# EAGLE design GK_Roland_Breakout (EAGLE 6.3)
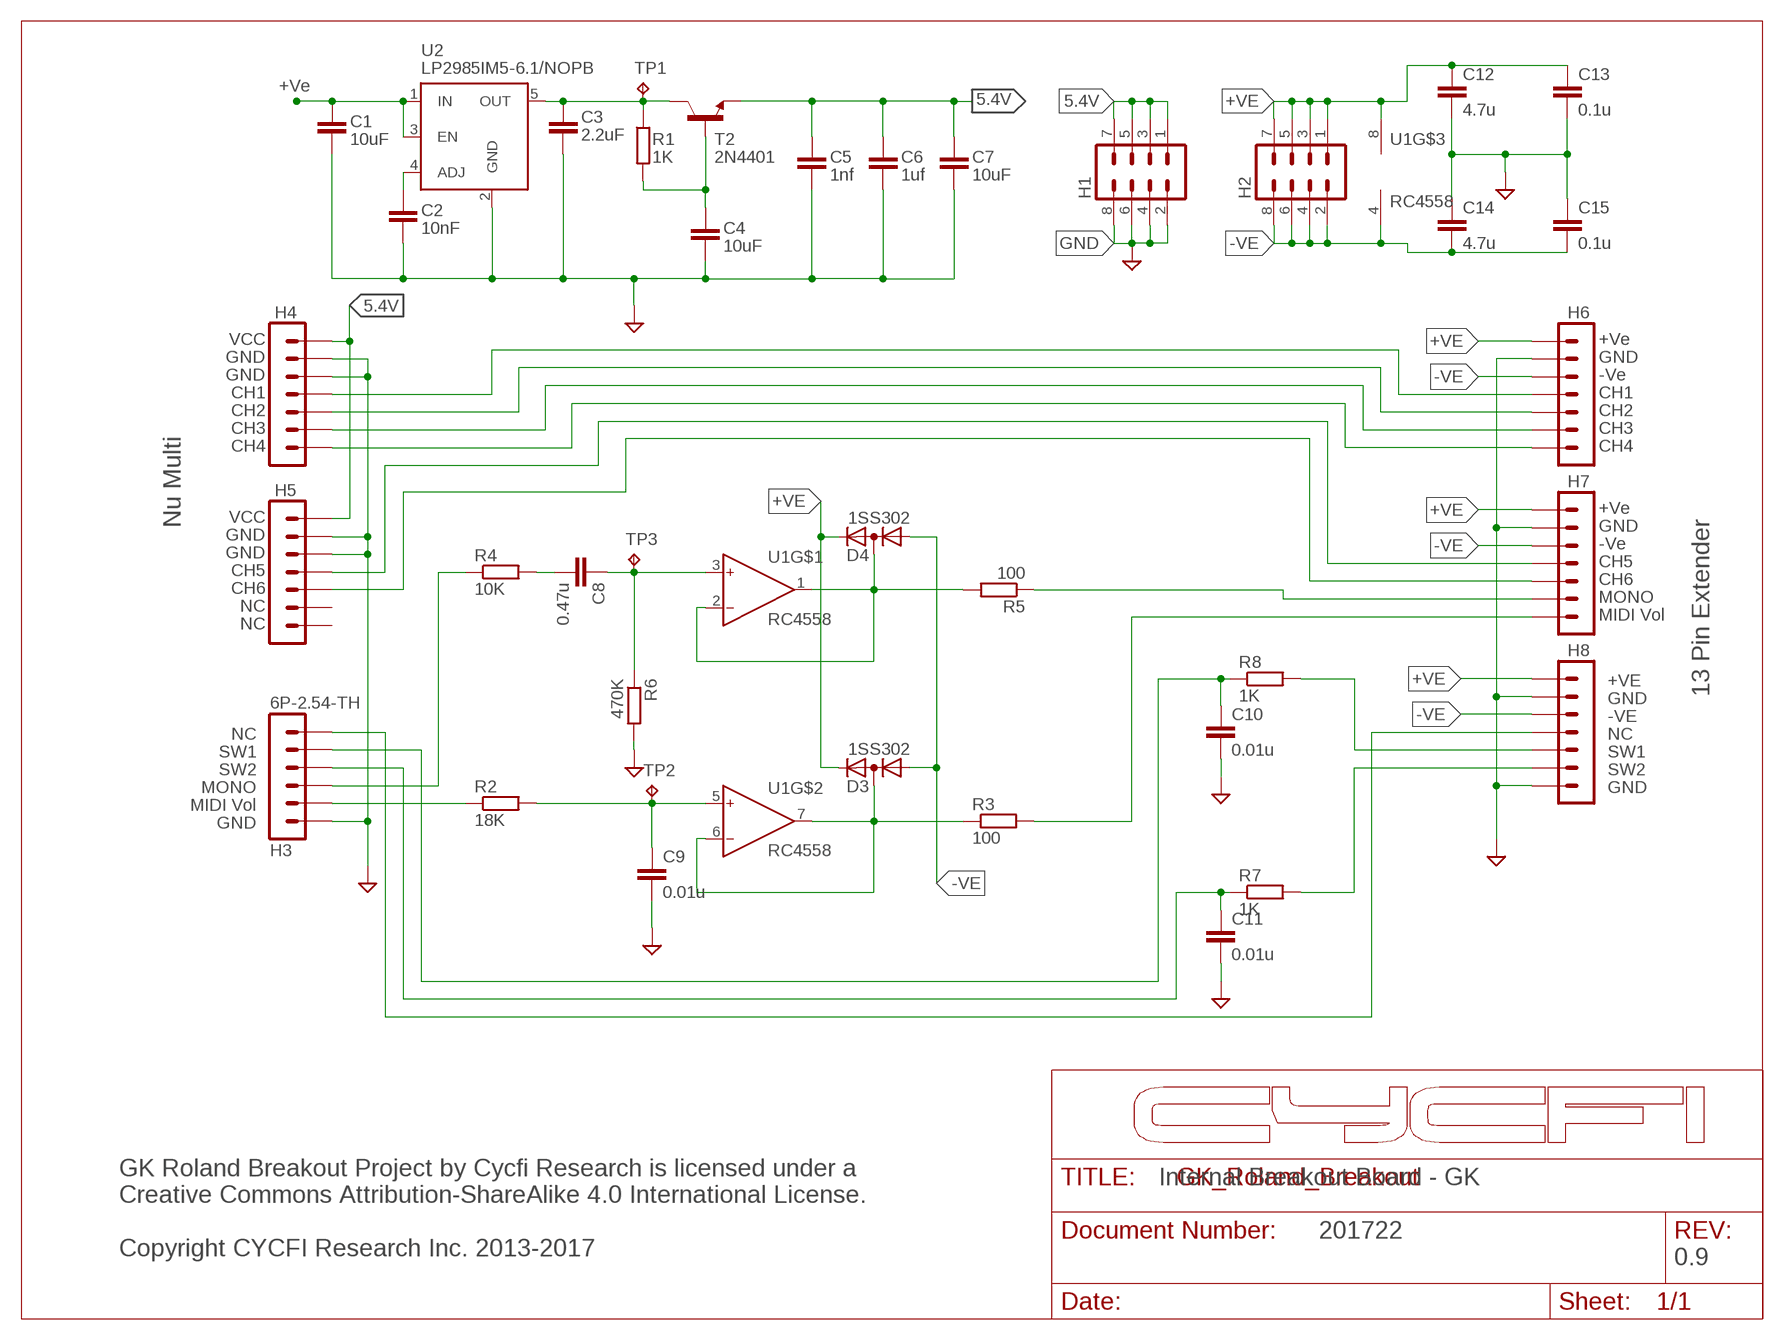
[diagram p0: schematic, sheet 1]

## Parts
C1  10uF  C-EUC0805  [C0805]
C2  10nF  C-EUC0805  [C0805]
C3  2.2uF  C-EUC0805  [C0805]
C4  10uF  C-EUC0805  [C0805]
C5  1nf  C-EUC0603  [C0603]
C6  1uf  C-EUC0603  [C0603]
C7  10uF  C-EUC0805  [C0805]
C8  0.47u  C-EUC0805  [C0805]
C9  0.01u  C-EUC0805  [C0805]
C10  0.01u  C-EUC0805  [C0805]
C11  0.01u  C-EUC0805  [C0805]
C12  4.7u  C-EUC0805  [C0805]
C13  0.1u  C-EUC0805  [C0805]
C14  4.7u  C-EUC0805  [C0805]
C15  0.1u  C-EUC0805  [C0805]
D3  1SS302  [SC70-3]
D4  1SS302  [SC70-3]
H1  MA04-2  [MA04-2]
H2  MA04-2  [MA04-2]
H3  6P-2.54-TH  [6P-2.54-TH]
H4  7P_ZIF_59453-071110EDHLF  [7P_ZIF_59453-071110EDHLF]
H5  7P_ZIF_59453-071110EDHLF  [7P_ZIF_59453-071110EDHLF]
H6  7P_ZIF_59453-071110EDHLF  [7P_ZIF_59453-071110EDHLF]
H7  7P_ZIF_59453-071110EDHLF  [7P_ZIF_59453-071110EDHLF]
H8  7P_ZIF_59453-071110EDHLF  [7P_ZIF_59453-071110EDHLF]
R1  1K  R-EU_R0402  [R0402]
R2  18K  R-EU_R0402  [R0402]
R3  100  R-EU_R0402  [R0402]
R4  10K  R-EU_R0402  [R0402]
R5  100  R-EU_R0402  [R0402]
R6  470K  R-EU_R0402  [R0402]
R7  1K  R-EU_R0402  [R0402]
R8  1K  R-EU_R0402  [R0402]
T2  2N4401  TRAN-MMBT2222A  [SOT23-3]
TP1  TPB1,27  [B1,27]
TP2  TPB1,27  [B1,27]
TP3  TPB1,27  [B1,27]
U1  RC4558  [SOIC-8]
U2  MIC5205-5V  MIC5219BM5  [SOT23-5]

## Nets
5.4V: C5.1 C6.1 C7.1 H1.1 H1.3 H1.5 H1.7 H4.P$1 H5.P$1 T2.2(E)
+VE: C1.1 C12.1 C13.1 D3.2(K) D4.2(K) H2.1 H2.3 H2.5 H2.7 H6.P$1 H7.P$1 H8.P$1 U1.8(V+) U2.1(IN) U2.3(EN)
-VE: C14.2 C15.2 D3.1(A) D4.1(A) H2.2 H2.4 H2.6 H2.8 H6.P$3 H7.P$3 H8.P$3 U1.4(V-)
GND: C1.2 C2.2 C3.2 C4.2 C5.2 C6.2 C7.2 C9.2 C10.2 C11.2 C12.2 C13.2 C14.1 C15.1 H1.2 H1.4 H1.6 H1.8 H3.6 H4.P$2 H4.P$3 H5.P$2 H5.P$3 H6.P$2 H7.P$2 H8.P$2 H8.P$7 R6.2 U2.2(GND)
N$1: C4.1 R1.2 T2.1(B)
N$3: C2.1 U2.4(ADJ)
N$5: H4.P$4 H6.P$4
N$6: H4.P$5 H6.P$5
N$7: H4.P$6 H6.P$6
N$8: H4.P$7 H6.P$7
N$9: H7.P$6 R5.1
N$10: H5.P$4 H7.P$4
N$11: D3.3(AK) R3.1 U1.6(IN-) U1.7(OUT)
N$12: C9.1 R2.2 TP2.TP U1.5(IN+)
N$13: H7.P$7 R3.2
N$14: C8.2 R4.2
N$15: C8.1 R6.1 TP3.TP U1.3(IN+)
N$16: D4.3(AK) R5.2 U1.1(OUT) U1.2(IN-)
N$18: H5.P$5 H7.P$5
N$19: C10.1 H3.2 R8.1
N$20: C11.1 H3.3 R7.1
N$23: H3.4 R4.1
N$24: H3.5 R2.1
N$25: H8.P$6 R7.2
N$26: H8.P$5 R8.2
N$27: H3.1 H8.P$4
NC1: C3.1 R1.1 T2.3(C) TP1.TP U2.5(OUT)
Unconnected: H5.P$6 H5.P$7

## Notes on the sheet
- LP2985IM5-6.1/NOPB
- +Ve
- VCC | +Ve
- GND | GND
- GND | -Ve
- CH1 | CH1
- CH2 | CH2
- CH3 | CH3
- CH4 | CH4
- +Ve
- Nu Multi | VCC
- GND
- GND
- -Ve
- GND
- CH5
- CH5
- CH6
- CH6
- MONO
- NC
- MIDI Vol
- NC
- +VE
- GND | 13 Pin Extender
- -VE
- NC | NC
- SW1 | SW1
- SW2 | SW2
- MONO | GND
- MIDI Vol
- GND
- Internal Breakout Board - GK
- 201722
- GK Roland Breakout Project by Cycfi Research is licensed under a 
  Creative Commons Attribution-ShareAlike 4.0 International License. 
  
  Copyright CYCFI Research Inc. 2013-2017
- 0.9

## Library data of the parts
C1-C15 = resistor:C-EU: CAPACITOR, European symbol
D3 D4 = CYCFI_semicon:1SS302
H1 H2 = con-lstb:MA04-2: PIN HEADER; OC_FARNELL: unknown; OC_NEWARK: unknown
H3 = CYCFI_Con:6P-2.54-TH
H4-H8 = CYCFI_Con:7P_ZIF_59453-071110EDHLF
R1-R8 = resistor:R-EU_: RESISTOR, European symbol
T2 = Cycfi:TRAN-MMBT2222A
TP1-TP3 = testpad:TP: Test pad
U1 = CYCFI_semicon:RC4558
U2 = v-reg-micrel:MIC5219BM5: VOLTAGE REGULATOR; MF: ALTERA CORPORATION; MPN: MIC5219BM5 TR; OC_FARNELL: 1100656; OC_NEWARK: 09J8939

## Board
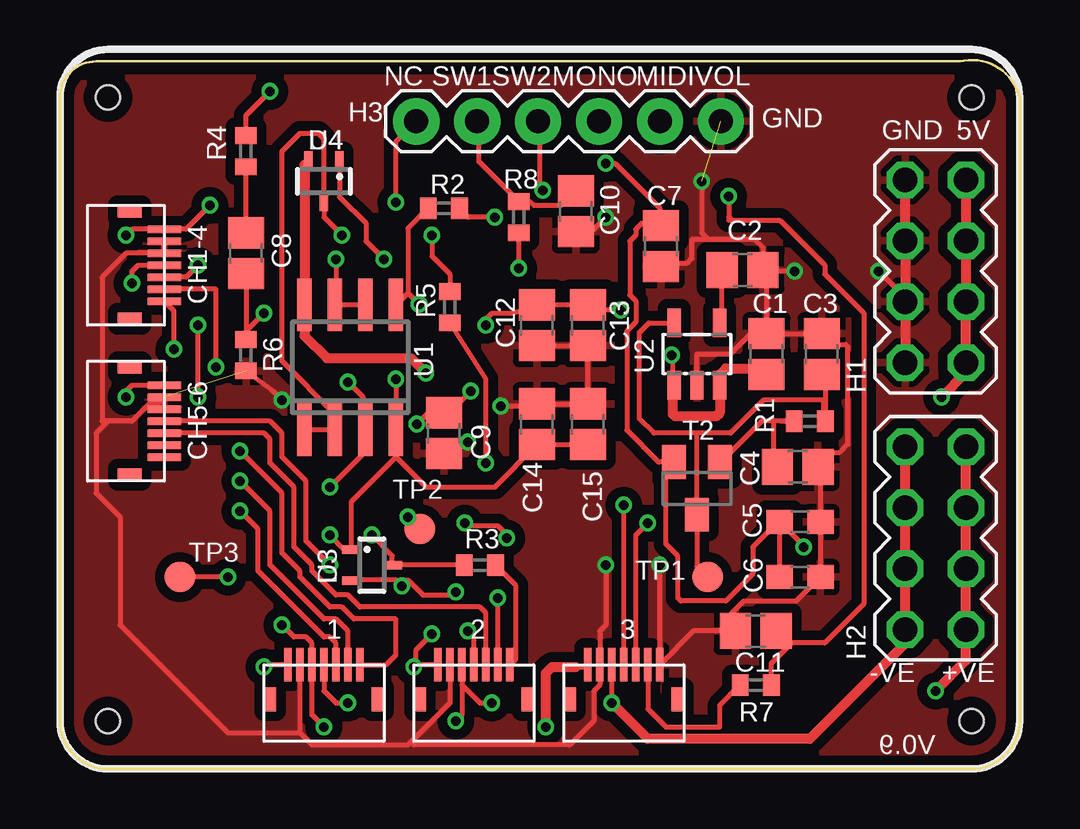
[diagram p1: board, top side]
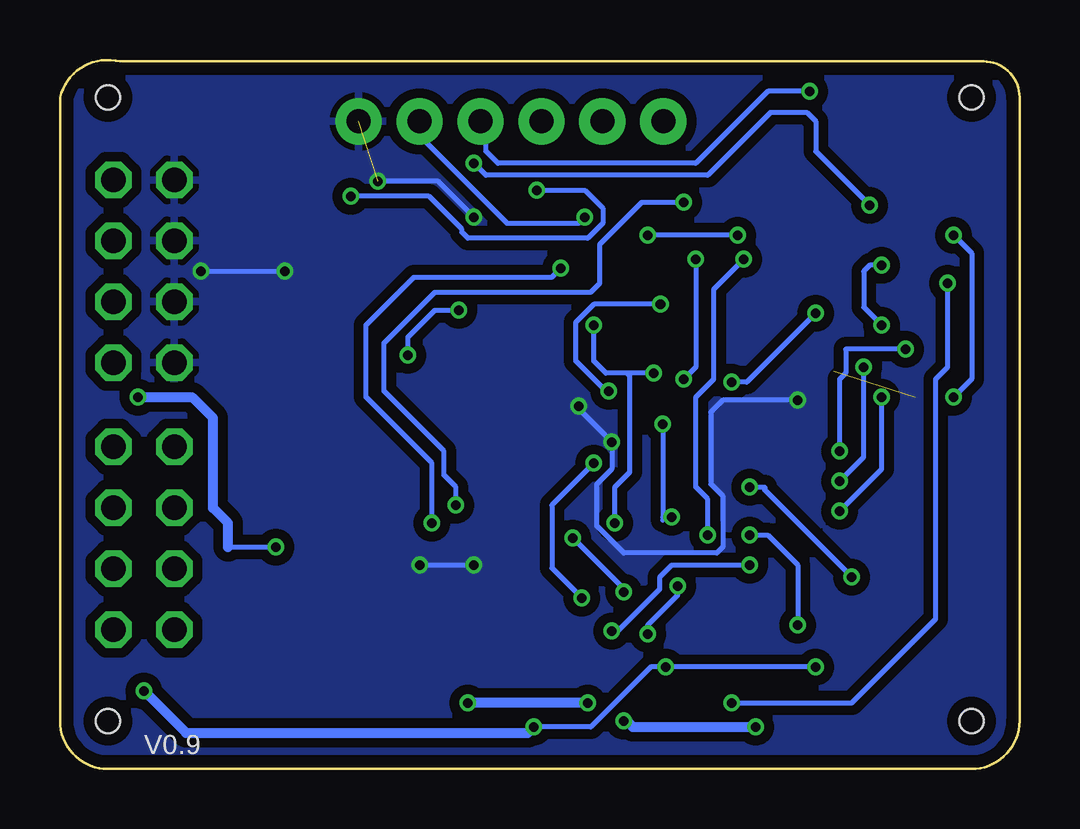
[diagram p2: board, bottom side, seen from below]

Size 40 x 29.56 mm. Coordinates in mm from the lower left corner, seen from the top.
Outline: 0,28 0,2 arc90 2,0 38,0 arc90 40,2 40,28 arc90 37.5,29.5 1.5,29.5 arc90 0,28
Copper layers (1*16): Top 0.035mm / dielectric 1.6mm / Bottom 0.035mm
Design rules "Elecrow_2-layer_PCB_eagle_rule": minimum track width 6mil, minimum drill 12mil, track to track 6mil, track to pad 8mil, pad to pad 12mil, via to via 12mil, smd to smd 0mil, copper to edge 20mil, drill to drill 10mil, minimum pad ring 6mil, minimum via ring 6mil, stop-mask expansion 0mil, vias tented up to drill 100mil, thermal gap 10mil
Holes 1 mm at 2,28 2,2 38,2 38,28

### Footprints (pad centres in the part's own frame; a part is rotated, then mirrored left to right if it is on the bottom)
C0805 = smd 1.3 x 1.5: 1 -0.85,0; 2 0.85,0
C0603 = smd 1.1 x 1: 1 -0.85,0; 2 0.85,0
SC70-3 = smd 0.35 x 0.8: 1 -0.65,-0.85; 2 0.65,-0.85; 3 0,0.85
MA04-2 = drill 1.016 octagon: 1 -3.81,-1.27; 2 -3.81,1.27; 3 -1.27,-1.27; 4 -1.27,1.27; 5 1.27,-1.27; 6 1.27,1.27; 7 3.81,-1.27; 8 3.81,1.27
6P-2.54-TH = drill 1 pad 1.93: 1 -6.35,0; 2 -3.81,0; 3 -1.27,0; 4 1.27,0; 5 3.81,0; 6 6.35,0
7P_ZIF_59453-071110EDHLF = smd 0.3 x 1.4: P$1 -1.5,1.6; P$2 -1,1.6; P$3 -0.5,1.6; P$4 0,1.6; P$5 0.5,1.6; P$6 1,1.6; P$7 1.5,1.6 | smd 0.52 x 1: ST1 -2.24,0.15; ST2 2.24,0.15
R0402 = smd 0.7 x 0.9: 1 -0.65,0; 2 0.65,0
SOT23-3 = smd 1 x 1.4: 1 -0.95,-1.1; 2 0.95,-1.1; 3 0,1.1
B1,27 = smd 1.27 x 1.27: TP 0,0
SOIC-8 = smd 0.6 x 2.2: 1 -1.905,-2.6; 2 -0.635,-2.6; 3 0.635,-2.6; 4 1.905,-2.6; 5 1.905,2.6; 6 0.635,2.6; 7 -0.635,2.6; 8 -1.905,2.6
SOT23-5 = smd 0.55 x 1.2: 1 -0.95,-1.3; 2 0,-1.3; 3 0.95,-1.3; 4 0.95,1.3; 5 -0.95,1.3

### Placement (x,y rotation side)
C1  29.45,17.3 90 top
C2  28.45,20.8 0 top
C3  31.75,17.3 90 top
C4  30.75,12.6 0 top
C5  30.85,10.3 0 top
C6  30.85,8 0 top
C7  25.05,21.8 270 top
C8  7.75,21.5 90 top
C9  16,14 270 top
C10  21.5,23.25 270 top
C11  29,5.75 180 top
C12  19.88,18.5 270 top
C13  22,18.5 270 top
C14  19.88,14.38 270 top
C15  22,14.38 270 top
D3  13,8.5 270 top
D4  11,24.5 180 top
H1  36.5,20.75 90 top
H2  36.5,9.62 90 top
H3  21.2,27 0 top
H4  2.75,21 270 top
H5  2.75,14.5 270 top
H6  11,2.75 0 top
H7  17.25,2.75 0 top
H8  23.5,2.75 0 top
R1  31.25,14.5 180 top
R2  16,23.38 180 top
R3  17.5,8.5 0 top
R4  7.75,25.75 270 top
R5  16.25,19.25 90 top
R6  7.75,17.25 270 top
R7  29,3.5 180 top
R8  19.12,23 270 top
T2  26.55,11.7 180 top
TP1  27,8 0 top
TP2  15,10 0 top
TP3  5,8 0 top
U1  12.1,16.75 0 top
U2  26.55,17.3 0 top

### Tracks (layer width: path | path; a pad name or v marks a point on that pad's centre or on a via)
5.4V  (via drill 0.4)
  Top 0.203: C6.1 C5.1 | v2.75,22.25 3,22.5 H4.P$1 5.25,22.5 v6.25,23.5 | v2.75,15.5 2.75,15.75 3,16 H5.P$1 | v31,9.25 31,9.3 C5.1 | v22.75,25.25 23.12,25.25 25,23.38 25,22.7 C7.1 24.95,22.75 24.25,22.75 24,22.5 24,22.25 23.75,22 23.75,19.75 24,19.5 24,18.62 23.62,18.25 23.62,14.12 24.95,12.8 T2.2 25.25,12.45 25.25,9.38 25.75,8.88 25.75,7.12 25.88,7 27.75,7 28.88,8.12 28.88,9.25 29.93,10.3 C5.1
  Top 0.406: H1.7 H1.5 H1.3 H1.1 37.77,16.52 v36.75,15.5
  Bottom 0.203: v2.75,22.25 2,21.5 2,16.25 v2.75,15.5 | 33,9.25 v31,9.25 | v22.75,25.25 22.25,24.75 13,24.75 10.38,27.38 8.88,27.38 8.5,27 8.5,25.75 v6.25,23.5
  Bottom 0.406: v36.75,15.5 34.5,15.5 33.62,14.62 33.62,10.88 33,10.25 33,9.25
+VE  (via drill 0.4)
  Top 0.203: 10.2,25.2 D4.2 | U1.8 10.2,18.3 | v17.75,18.5 17.75,18.75 18,19 18.88,19 C12.1 C13.1 22.23,19.12 v23.38,19.12 | 21.5,4.25 21.9,4.25 H8.P$1 | H7.P$1 14.85,4.35 | 14.85,4.35 v14.75,4.25 | 14.85,4.35 14.85,4.97 v15.5,5.62 | v14.25,7.62 14,7.88 | 14,7.88 12.18,7.88 D3.2 | H6.P$1 8.6,4.35 v8.5,4.25 | 25.55,15.95 25.55,17.2 v25.5,17.25 | 14,7.88 14.5,7.88 15.12,7.25 16.38,7.25 v16.5,7.38 | v16.88,10.25 17,10.12 18.25,10.12 18.62,9.75 v18.62,9.62
  Top 0.406: U2.1 25.55,15.95 25.55,14.8 25.65,14.7 27.35,14.7 27.5,14.85 U2.3 27.5,16.45 27.75,16.7 29.2,16.7 C1.1 | v36.5,3.25 37.77,4.52 H2.1 H2.3 H2.5 H2.7 | v20.25,1.75 20.25,4 20.5,4.25 21.5,4.25 | 10.2,25.2 U1.8 | 10.2,18.3 10.2,18.05 11.12,17.12 14.62,17.12 v15.25,16.5
  Bottom 0.203: v15.25,16.5 16.38,16.5 | 16.38,16.5 17.25,16.5 17.75,17 v17.75,18.5 | v20.25,1.75 17.88,1.75 15.38,4.25 v14.75,4.25 v8.5,4.25 | v15.5,5.62 15.5,6 14.25,7.25 v14.25,7.62 | v25.5,17.25 25.5,18 24.38,19.12 v23.38,19.12 | v16.88,10.25 16.88,11.75 16.25,12.38 16.25,16.38 16.38,16.5 | v16.5,7.38 16.5,7.5 v18.62,9.62
  Bottom 0.406: v36.5,3.25 34.75,1.5 20.5,1.5 v20.25,1.75
-VE  (via drill 0.4)
  Top 0.203: D4.1 11.65,23.85 12.75,22.75 12.75,22 v13.5,21.25 | v14,16.25 U1.4 | U1.4 | v18,2.75 17.5,2.75 16.75,3.5 H7.P$3 16.75,2.25 v16.5,2 | v23,2.75 H8.P$3 | v11.25,9.75 11.85,9.15 D3.1 12.15,11.15 14,13 | 14,13 U1.4 | v9.25,6 9.75,5.5 10.25,5.5 10.5,5.25 H6.P$3 10.5,2.25 v11,1.75 | U1.4 | 14,13 15.25,11.75 18.12,11.75 19,12.62 19,12.65 C14.2 C15.2
  Top 0.406: v23,2.75 24.5,1.25 31.25,1.25 35.25,5.25 35.25,5.79 H2.2 H2.4 H2.6 H2.8
  Bottom 0.203: v13.5,21.25 13.5,16.75 v14,16.25 | v11.25,9.75 10.5,9.75 9.25,8.5 v9.25,6
  Bottom 0.406: v18,2.75 v23,2.75 | v16.5,2 16.38,2 16.12,1.75 v11,1.75
GND  (via drill 0.4)  (2 unrouted)
  Top 0.203: U2.2 26.55,17.3 27.95,17.3 28.8,18.15 C1.2 | C2.2 29.45,20.65 C1.2 | C1.2 C3.2 32.2,17.7 32.75,17.7 32.85,17.6 32.85,13.55 32.5,13.2 32.2,13.2 C4.2 31.7,12.5 C5.2 C6.2 30.7,7 28.5,7 28,6.5 C11.2 26.4,5.75 H8.P$7 v25,8.5 | C7.2 25.2,21.1 26.15,21.1 26.35,21.3 26.35,22.1 27,22.1 | 27,22.1 28.95,22.1 29.3,21.75 C2.2 | H7.P$2 16.25,2.75 14.62,1.12 | 14.62,1.12 14.5,1 10.5,1 10,1.5 | 10,1.5 H6.P$2 | C10.2 22,22.25 v22.75,23 22.88,22.88 | v26.75,24.5 26.75,22.35 27,22.1 | 14.62,1.12 14.75,1 21.25,1 22.25,2 22.25,3.25 22.5,3.5 H8.P$2 22.5,5.75 22.75,6 v22.75,8.5 | C9.2 16.75,13.75 16.88,13.75 v17,13.62 | R6.2 8.88,15.75 v9.25,15.38 | H1.2 35.23,19.64 v34.12,20.75 | v30.62,20.75 29.35,20.75 C2.2 | v18.38,15.12 19.77,15.12 C14.1 C15.1 C13.2 C12.2 | H4.P$2 H4.P$3 2.75,21.5 1.75,20.5 1.75,14.5 2,14.5 | H5.P$3 H5.P$2 | H5.P$2 4.1,15.25 3.75,15.25 | 3.75,15.25 3,14.5 2,14.5 | H5.P$2 4,15.5 3.75,15.25 | 2,14.5 1.5,14 1.5,11.5 2.5,10.5 2.5,6 7,1.5 10,1.5
  Top 0.406: H1.8 H1.6 H1.4 H1.2
  Bottom 0.203: v22.75,23 24.25,24.5 v26.75,24.5 | v25,8.5 v22.75,8.5 | v9.25,15.38 12.38,15.38 12.88,14.88 12.88,11.88 12.38,11.38 12.38,9.25 12.62,9 16.5,9 17.62,10.12 17.62,11.88 17,12.5 v17,13.62 18.38,15 v18.38,15.12 | v34.12,20.75 v30.62,20.75
  pour Top (isolate 0.406): 0,30 0,0 40,0 40,30
  pour Bottom (isolate 0.406): 0,30 0,0 40,0 40,30
N$1
  Top 0.203: C4.1 29.75,12.75 29.75,14.5 | 30.05,14.5 R1.2 29.75,14.5 | 29.75,14.5 29.25,14.5 27.55,12.8 T2.1
N$3
  Top 0.203: U2.4 27.6,18.7 C2.1
N$5  (via drill 0.4)
  Top 0.203: H6.P$4 11,3.25 11.5,2.75 v12,2.75 | v3,20.25 3,20.75 3.25,21 H4.P$4
  Bottom 0.203: v12,2.75 7,2.75 3.5,6.25 3.5,16.25 3,16.75 v3,20.25
N$6  (via drill 0.4)
  Top 0.203: H6.P$5 11.5,5.25 11.25,5.5 11,5.5 8.25,8.25 8.25,10 v7.5,10.75 | v5.75,15.5 v5.75,18.5 | v5.75,21 5.25,20.5 H4.P$5
  Bottom 0.203: v7.5,10.75 5.75,12.5 v5.75,15.5 | v5.75,18.5 6.5,19.25 6.5,20.75 6.25,21 v5.75,21
N$7  (via drill 0.4)
  Top 0.203: v7.5,12 8.75,10.75 8.75,8.5 11,6.25 11.5,6.25 12,5.75 H6.P$6 | v6.5,16.75 6.5,20 H4.P$6
  Bottom 0.203: v7.5,12 6.5,13 v6.5,16.75
N$8  (via drill 0.4)
  Top 0.203: v7.5,13.25 9.25,11.5 9.25,9 10,8.25 10,8 11.25,6.75 11.75,6.75 12.25,6.25 14,6.25 14,4.75 13.6,4.35 H6.P$7 | v4.75,17.5 4.75,19.1 H4.P$7
  Bottom 0.203: v7.5,13.25 7.5,16.25 7.25,16.5 7.25,17.5 v4.75,17.5
N$9  (via drill 0.4)
  Top 0.203: v17.75,12.75 17.75,16.25 R5.1 | H7.P$6 v18.25,7.12
  Bottom 0.203: v17.75,12.75 19.5,11 19.5,8.38 v18.25,7.12
N$10  (via drill 0.4)
  Top 0.203: H7.P$4 17.25,5.5 v17,5.75 | v11.25,8.5 10.25,9.5 10.25,12 9.25,13 9.25,14 8.75,14.5 H5.P$4
  Bottom 0.203: v17,5.75 16.75,5.75 15,7.5 15,8 14.5,8.5 v11.25,8.5
N$11  (via drill 0.4)
  Top 0.203: v13,9.75 13.85,8.9 D3.3 R3.1 | v11.5,21.25 11.5,19.39 U1.7 U1.6
  Bottom 0.203: v13,9.75 13,11.25 13.5,11.75 13.5,15.5 12.75,16.25 12.75,20 v11.5,21.25
N$12  (via drill 0.4)
  Top 0.203: 14.5,19.84 14.5,22.52 R2.2 | 14.5,19.84 U1.5 | v17.12,15.75 16.38,15 C9.1 15.5,15 v14.88,14.38 | v14.97,19.38 14.5,19.84 | TP2.TP v14.5,10.5
  Bottom 0.203: v17.12,15.75 17.25,15.75 18.5,17 18.5,18.62 17.75,19.38 v14.97,19.38 | v14.88,14.38 14.88,10.5 | 14.88,10.5 14.88,10.38 | v14.5,10.5 14.88,10.5
N$13
  Top 0.203: H7.P$7 19,4.6 19,7.65 R3.2
N$14
  Top 0.203: C8.2 R4.2
N$15  (via drill 0.4)
  Top 0.203: C8.1 R6.1 7.75,18.25 v8.5,19 | v11.25,11.75 12.73,13.23 U1.3 12.62,14.26 12.62,15.5 v12,16.12 | v7,8 TP3.TP
  Bottom 0.203: v11.25,11.75 10.62,11.75 10.62,11.62 v7,8 | v8.5,19 11.38,16.12 v12,16.12
N$16  (via drill 0.4)
  Top 0.203: v11.75,22.25 11,23 D4.3 11,26.25 10.75,26.5 10,26.5 9.25,25.75 9.25,17 11.46,14.79 U1.2 U1.1 | v15.5,22.25 15.5,21.38 16.25,20.62 R5.2
  Bottom 0.203: v11.75,22.25 v15.5,22.25
N$18
  Top 0.203: H7.P$5 17.75,6.5 17.5,6.75 12.5,6.75 12,7.25 11.5,7.25 10.5,8.25 10.5,8.5 9.75,9.25 9.75,11.75 8.75,12.75 8.75,13.75 8.5,14 H5.P$5
N$19
  Top 0.203: C10.1 20.9,23.5 19.75,23.5 19.6,23.65 R8.1 17.46,25.32 17.46,26.93 H3.2
N$20  (via drill 0.4)
  Top 0.203: 30.5,5.25 C11.1 | 27.88,22.88 28,22.88 | 28,22.88 30,22.88 31.88,21 31.88,20.62 33.5,19 33.5,6.88 31.88,5.25 30.5,5.25 | v20.12,24.12 20,24.25 20,26.93 H3.3 | v27.88,23.88 27.88,23 28,22.88 | R7.1 29.65,4.4 30.5,5.25
  Bottom 0.203: v20.12,24.12 18.12,24.12 17.38,23.38 17.38,22.75 18,22.12 23,22.12 23.25,22.38 23.25,22.5 24.62,23.88 v27.88,23.88
N$23  (via drill 0.4)
  Top 0.203: R4.1 7.75,27.25 v8.75,28.25
  Bottom 0.203: v8.75,28.25 10.5,28.25 13.5,25.25 21.75,25.25 22.25,25.75 22.25,26.78 H3.4
N$24  (via drill 0.4)
  Top 0.203: v18.12,23 17.02,23 R2.1
  Bottom 0.203: v18.12,23 18.38,22.75 21.38,22.75 25.12,26.5 25.12,26.89 H3.5
N$25
  Top 0.203: H8.P$6 24.5,2.5 25.25,1.75 27.5,1.75 27.5,2.65 R7.2
N$26  (via drill 0.4)
  Top 0.203: H8.P$5 24,9.75 v24.5,10.25 | v19.12,20.88 R8.2
  Bottom 0.203: v24.5,10.25 24.5,12.75 27.25,15.5 27.25,18.5 25.25,20.5 19.5,20.5 v19.12,20.88
N$27  (via drill 0.4)
  Top 0.203: H8.P$4 v23.5,11 | v14,23.62 14,26.15 H3.1
  Bottom 0.203: v23.5,11 23.5,11.75 24,12.25 24,13.25 26.5,15.75 26.5,17.75 24.38,19.88 17.88,19.88 17.5,20.25 17.5,21.88 15.75,23.62 v14,23.62
NC1
  Top 0.203: C3.1 31.9,16.3 R1.1 31.85,14.55 31.85,15.3 31.75,15.4 29.35,15.4 27.95,14 26.55,14 | 26.55,14 24.75,14 24.15,14.6 24.15,18.2 24.55,18.6 U2.5 | 26.55,14 T2.3 26.55,8.45 TP1.TP

### Text on the board
tNames: NC | SW1 | SW2 | MONO | MIDIVOL | GND | GND | 5V | CH1-4 | CH5-6 | 1 | 2 | 3 | -VE | +VE
bNames: V0.9
_tNames: NC | SW1 | SW2 | MONO | MIDIVOL | U4 | H3 | GND | GND | 5V | R4 | R2 | R8 | C10 | C7 | C2 | C8 | R5 | C12 | C13 | CH1-4 | C1 | C3 | R6 | U1 | U2 | H1 | C9 | T2 | R1 | CH5-6 | C14 | C15 | C4 | TP2 | C5 | TP3 | U3 | R3 | TP1 | C6 | 1 | 2 | 3 | C11 | H2 | -VE | +VE | R7 | V0.9